# EAGLE design humidor_controller_v32 (EAGLE 6.2)
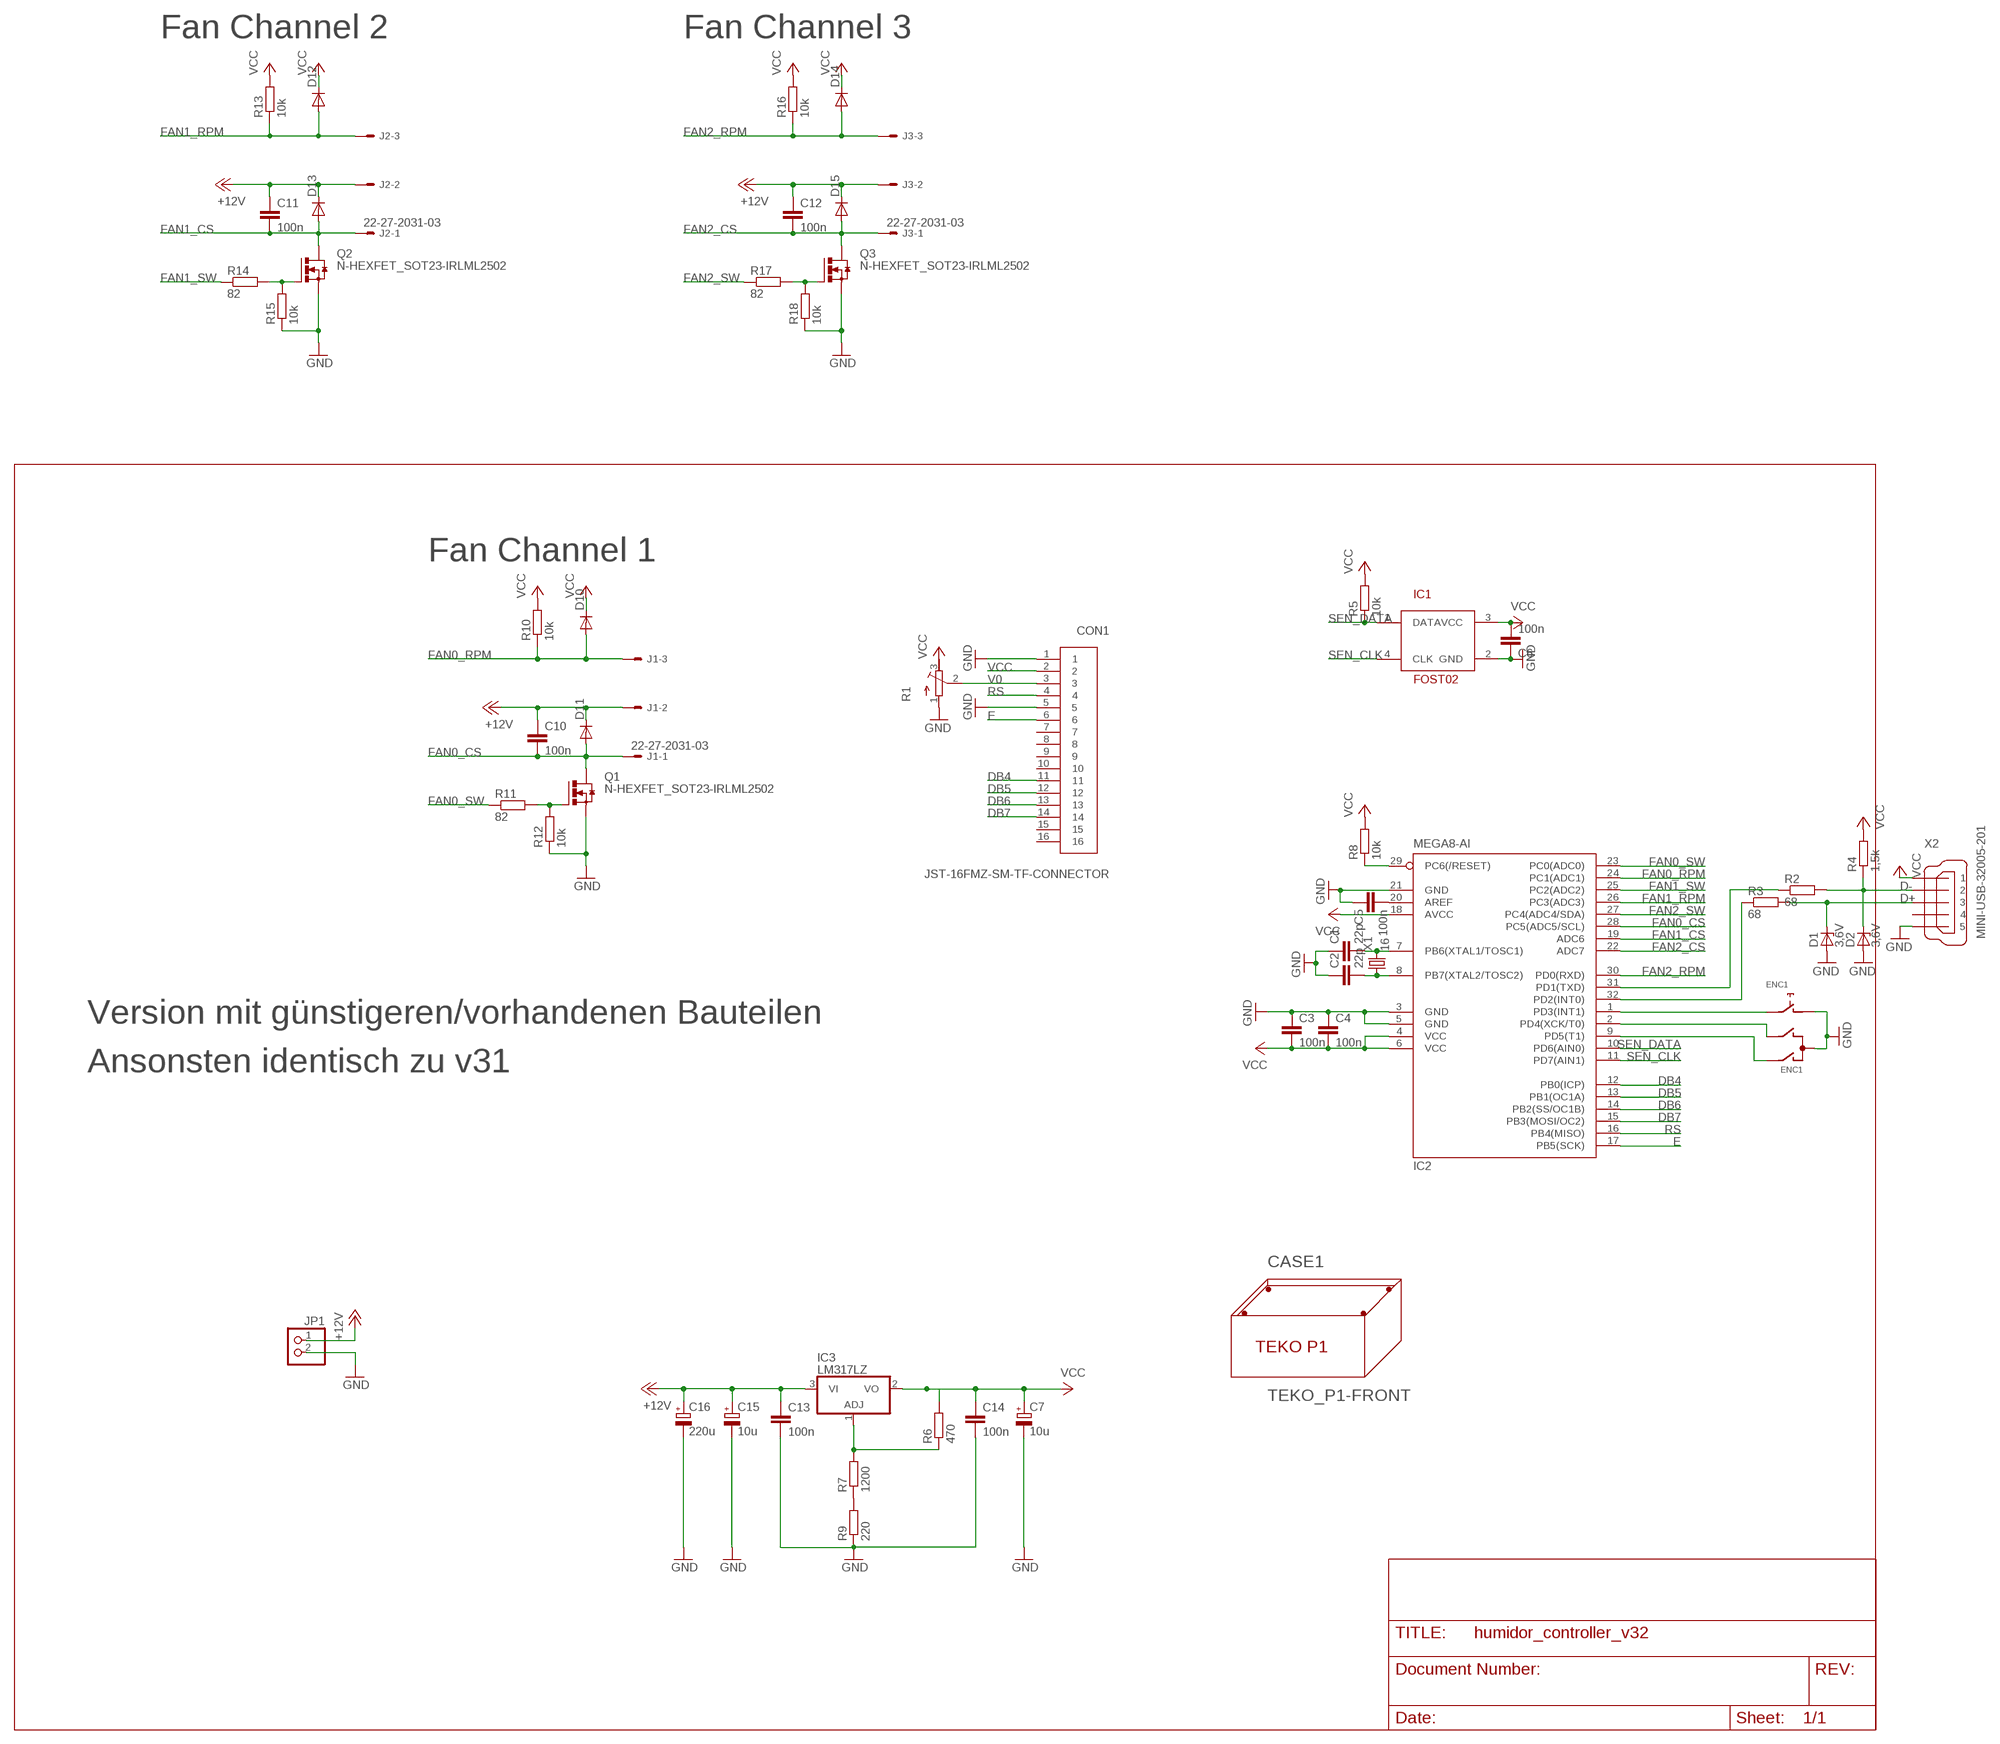
[diagram p0: schematic, sheet 1]

## Parts
C1  22p  C-EUC0805  [C0805]
C2  22p  C-EUC0805  [C0805]
C3  100n  C-EUC0805  [C0805]
C4  100n  C-EUC0805  [C0805]
C5  100n  C-EUC0805  [C0805]
C6  100n  C-EUC0805  [C0805]
C7  10u  CPOL-EUD  [PANASONIC_D]
C10  100n  C-EUC0805  [C0805]
C11  100n  C-EUC0805  [C0805]
C12  100n  C-EUC0805  [C0805]
C13  100n  C-EUC0805  [C0805]
C14  100n  C-EUC0805  [C0805]
C15  10u  CPOL-EUD  [PANASONIC_D]
C16  220u  CPOL-EUG  [PANASONIC_G]
CASE1  TEKO_P1-FRONT  [TEKO_P1_FRONT]
CON1  JST-16FMZ-SM-TF-CONNECTOR  [FFC-16POS-SMT-1MM-HORIZ]
D1  3,6V  ZENER-DIODEDO34-7  [DO34Z7]
D2  3,6V  ZENER-DIODEDO34-7  [DO34Z7]
D10  DIODE-SOD323-R  [SOD323-R]
D11  DIODE-SOD323-R  [SOD323-R]
D12  DIODE-SOD323-R  [SOD323-R]
D13  DIODE-SOD323-R  [SOD323-R]
D14  DIODE-SOD323-R  [SOD323-R]
D15  DIODE-SOD323-R  [SOD323-R]
ENC1  NOBLE_RE0124  [RE0124]
IC1  FOST02  [FOST02]
IC2  MEGA8-AI  [TQFP32-08]
IC3  LM317LZ  [TO92]
J1  22-27-2031-03  [6410-03]
J2  22-27-2031-03  [6410-03]
J3  22-27-2031-03  [6410-03]
JP1  PINHD-1X2  [1X02]
Q1  N-HEXFET_SOT23-IRLML2502  [SOT23]
Q2  N-HEXFET_SOT23-IRLML2502  [SOT23]
Q3  N-HEXFET_SOT23-IRLML2502  [SOT23]
R1  R-TRIMM64W  [RTRIM64W]
R2  68  R-EU_R0805  [R0805]
R3  68  R-EU_R0805  [R0805]
R4  1,5k  R-EU_R0805  [R0805]
R5  10k  R-EU_R0805  [R0805]
R6  470  R-EU_R0805  [R0805]
R7  1200  R-EU_R0805  [R0805]
R8  10k  R-EU_R0805  [R0805]
R9  220  R-EU_R0805  [R0805]
R10  10k  R-EU_R0805  [R0805]
R11  82  R-EU_R0805  [R0805]
R12  10k  R-EU_R0805  [R0805]
R13  10k  R-EU_R0805  [R0805]
R14  82  R-EU_R0805  [R0805]
R15  10k  R-EU_R0805  [R0805]
R16  10k  R-EU_R0805  [R0805]
R17  82  R-EU_R0805  [R0805]
R18  10k  R-EU_R0805  [R0805]
X1  16  CRYSTALHC49UP  [HC49UP]
X2  MINI-USB-32005-201  [32005-201]

## Nets
+12V: C10.1 C11.1 C12.1 C13.1 C15.+ C16.+ D11.C D13.C D15.C IC3.3(VI) J1.2 J2.2 J3.2 JP1.1
D+: D1.C R3.2 X2.3
D-: D2.C R2.2 R4.1 X2.2
DB4: CON1.11 IC2.12(PB0(ICP))
DB5: CON1.12 IC2.13(PB1(OC1A))
DB6: CON1.13 IC2.14(PB2(SS/OC1B))
DB7: CON1.14 IC2.15(PB3(MOSI/OC2))
E: CON1.6 IC2.17(PB5(SCK))
FAN0_CS: C10.2 D11.A IC2.28(PC5(ADC5/SCL)) J1.1 Q1.3(D)
FAN0_RPM: D10.A IC2.24(PC1(ADC1)) J1.3 R10.1
FAN0_SW: IC2.23(PC0(ADC0)) R11.1
FAN1_CS: C11.2 D13.A IC2.19(ADC6) J2.1 Q2.3(D)
FAN1_RPM: D12.A IC2.26(PC3(ADC3)) J2.3 R13.1
FAN1_SW: IC2.25(PC2(ADC2)) R14.1
FAN2_CS: C12.2 D15.A IC2.22(ADC7) J3.1 Q3.3(D)
FAN2_RPM: D14.A IC2.30(PD0(RXD)) J3.3 R16.1
FAN2_SW: IC2.27(PC4(ADC4/SDA)) R17.1
GND: C1.1 C2.1 C3.1 C4.1 C5.1 C6.1 C7.- C13.2 C14.2 C15.- C16.- CON1.1 CON1.5 D1.A D2.A ENC1.+ ENC1.C IC1.2(GND) IC2.3(GND) IC2.5(GND) IC2.21(GND) JP1.2 Q1.2(S) Q2.2(S) Q3.2(S) R1.1(E) R9.1 R12.1 R15.1 R18.1 X2.5
N$1: IC2.29(PC6(/RESET)) R8.1
N$2: C2.2 IC2.8(PB7(XTAL2/TOSC2)) X1.1
N$3: C1.2 IC2.7(PB6(XTAL1/TOSC1)) X1.2
N$4: Q2.1(G) R14.2 R15.2
N$5: Q3.1(G) R17.2 R18.2
N$7: C5.2 IC2.20(AREF)
N$9: Q1.1(G) R11.2 R12.2
N$10: R7.1 R9.2
N$11: IC2.31(PD1(TXD)) R2.1
N$13: ENC1.- IC2.1(PD3(INT1))
N$14: ENC1.B IC2.2(PD4(XCK/T0))
N$15: ENC1.A IC2.9(PD5(T1))
N$16: IC2.32(PD2(INT0)) R3.1
N$17: IC3.1(ADJ) R6.1 R7.2
RS: CON1.4 IC2.16(PB4(MISO))
SEN_CLK: IC1.4(CLK) IC2.11(PD7(AIN1))
SEN_DATA: IC1.1(DATA) IC2.10(PD6(AIN0)) R5.1
V0: CON1.3 R1.2(S)
VCC: C3.2 C4.2 C6.2 C7.+ C14.1 CON1.2 D10.C D12.C D14.C IC1.3(VCC) IC2.4(VCC) IC2.6(VCC) IC2.18(AVCC) IC3.2(VO) R1.3(A) R4.2 R5.2 R6.2 R8.2 R10.2 R13.2 R16.2 X2.1
Unconnected: CON1.7 CON1.8 CON1.9 CON1.10 CON1.15 CON1.16 X2.4

## Notes on the sheet
- Fan Channel 2 | Fan Channel 3
- Fan Channel 1
- Version mit günstigeren/vorhandenen Bauteilen
- Ansonsten identisch zu v31

## Library data of the parts
C1 C2 C13 C14 = rcl:C-EU: CAPACITOR, European symbol
C3-C6 C10-C12 = resistor:C-EU: CAPACITOR, European symbol
C7 C15 C16 = rcl:CPOL-EU: POLARIZED CAPACITOR, European symbol
CASE1 = ferdinandkeil:TEKO_P1-: TEKO P1 Case - Serie Optative 85 x 56 x 35 mm
CON1 = ferdinandkeil:JST-16FMZ-SM-TF-CONNECTOR
D1 D2 = diode:ZENER-DIODE: Z-Diode
D10-D15 = diode:DIODE-: DIODE
ENC1 = ferdinandkeil:NOBLE_RE0124: NOBLE RE0124 Rotary Encoder w/ Push-Button
IC1 = RFMxx:FOST02
IC2 = atmel:MEGA8: MICROCONTROLLER 8 Kbytes FLASH, 1 kbytes SRAM, 512 bytes EEPROM, USART, 6-channel 10 bit ADC, 2-channel 8 bit ADC Pin compatible with Atmega48, ATMega88, ATMega168 Source: avr.lbr
IC3 = linear:*317: Positive VOLTAGE REGULATOR
J1-J3 = con-molex:22-?-03: CONNECTOR wire to board 2.54 mm (.1 inch) pitch header
JP1 = pinhead:PINHD-1X2: PIN HEADER
Q1-Q3 = ferdinandkeil:N-HEXFET_?-*: HEXFET® Power MOSFET
R1 = rcl:R-TRIMM: Trimm resistor
R2-R18 = resistor:R-EU_: RESISTOR, European symbol
X1 = crystal:CRYSTAL: CRYSTAL
X2 = con-cypressindustries:MINI-USB-: MINI USB-B Conector Source: www.cypressindustries.com

## Board
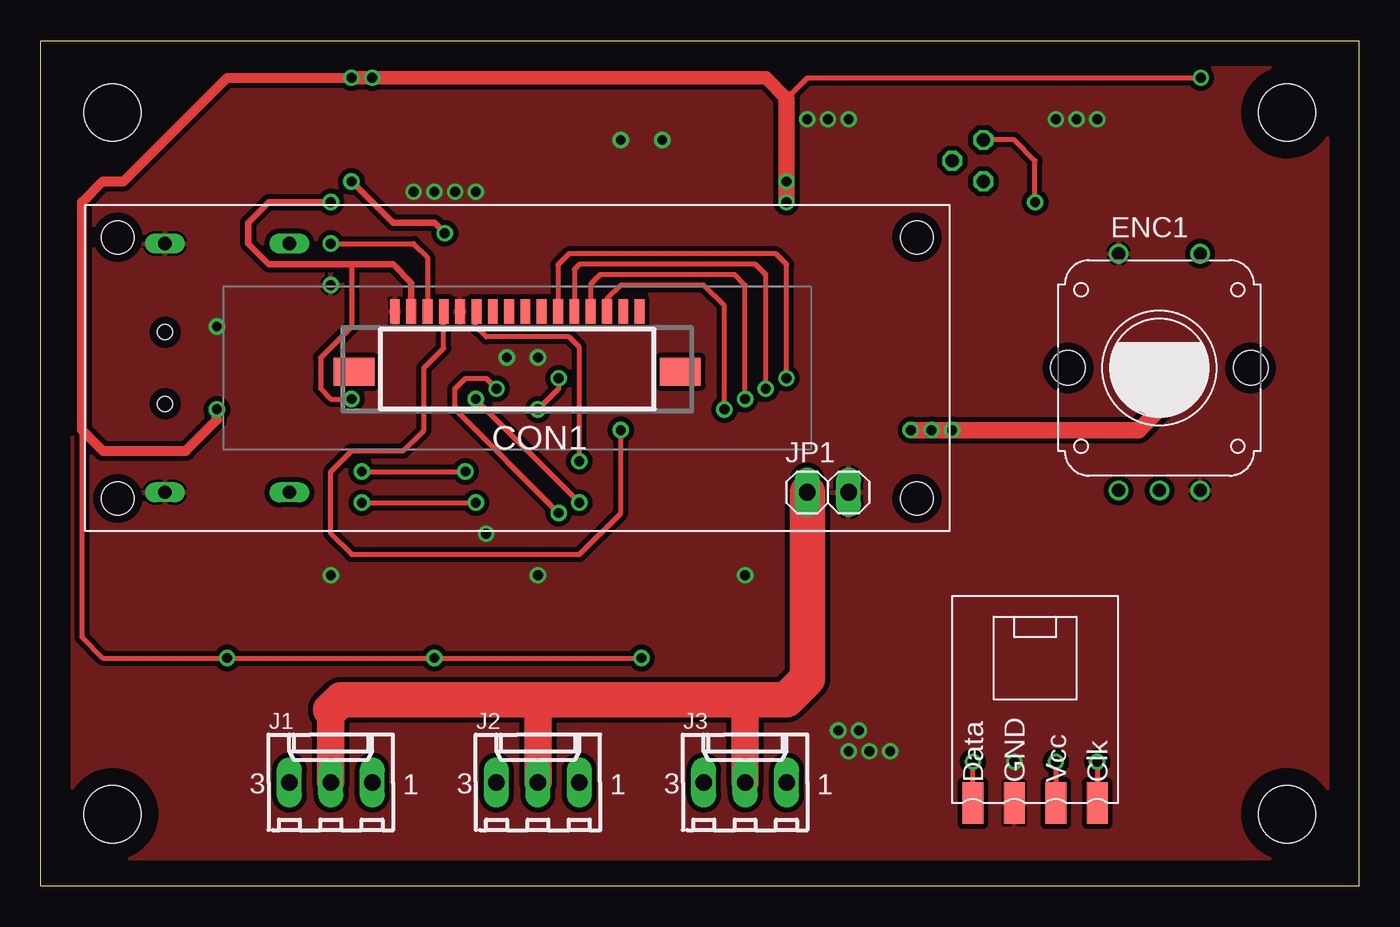
[diagram p1: board, top side]
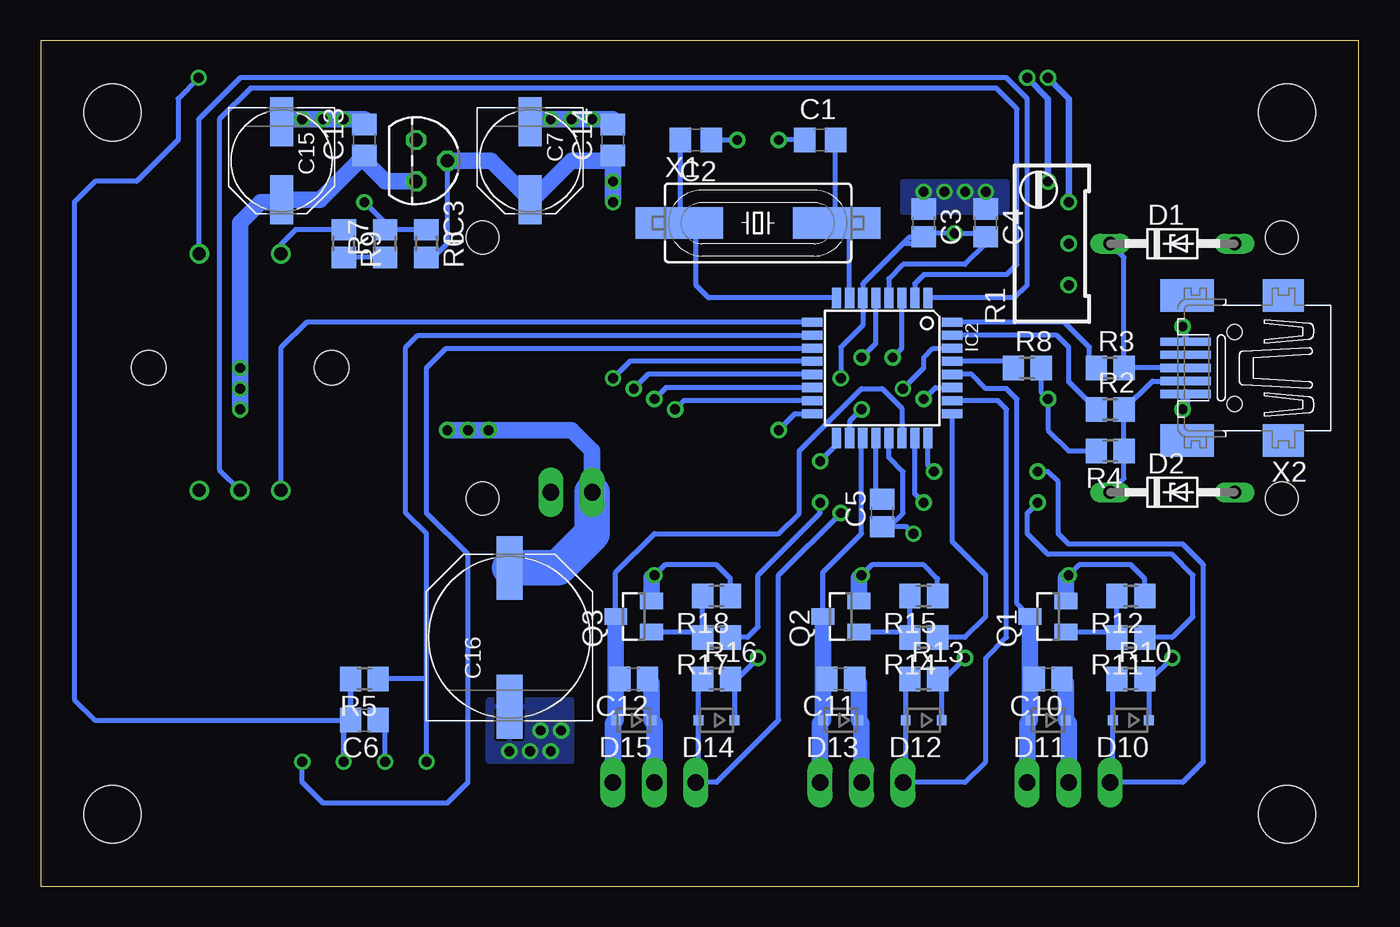
[diagram p2: board, bottom side, seen from below]

Size 80.8 x 51.8 mm. Coordinates in mm from the lower left corner, seen from the top.
Copper layers (1*16): Top 0.035mm / dielectric 1.5mm / Bottom 0.035mm
Design rules "jakob_kleinen": minimum track width 0.15mm, minimum drill 0.3mm, track to track 0.15mm, track to pad 0.15mm, pad to pad 0.15mm, via to via 0.15mm, smd to smd 0.15mm, copper to edge 0.5mm, drill to drill 0.2mm, minimum pad ring 0.2mm, minimum via ring 0.2mm, stop-mask expansion 4mil, vias tented up to drill 0.8mm, thermal gap 0.15mm

### Footprints (pad centres in the part's own frame; a part is rotated, then mirrored left to right if it is on the bottom)
C0805 = smd 1.3 x 1.5: 1 -0.95,0; 2 0.95,0
C0805' = smd 1.3 x 1.5: 1 -0.85,0; 2 0.85,0
PANASONIC_D = smd 3 x 1.4: + 2.4,0; - -2.4,0
PANASONIC_G = smd 3.9 x 1.6: + 4.25,0; - -4.25,0
TEKO_P1_FRONT = hole 3.5: 4.4,4.4; 4.4,47.4; 76.4,4.4; 76.4,47.4
FFC-16POS-SMT-1MM-HORIZ = smd 0.6 x 1.5: 1 7.5,-2.2; 2 6.5,-2.2; 3 5.5,-2.2; 4 4.5,-2.2; 5 3.5,-2.2; 6 2.5,-2.2; 7 1.5,-2.2; 8 0.5,-2.2; 9 -0.5,-2.2; 10 -1.5,-2.2; 11 -2.5,-2.2; 12 -3.5,-2.2; 13 -4.5,-2.2; 14 -5.5,-2.2; 15 -6.5,-2.2; 16 -7.5,-2.2 | smd 2.5 x 1.7: 17 10,1.5; 18 -10,1.5
DO34Z7 = drill 0.813 long: A 3.81,0; C -3.81,0
SOD323-R = smd 0.6 x 0.6: A 1.1,0; C -1.1,0
RE0124 = drill 0.8 pad 1 round: + -2.5,7; - 2.5,7; A -2.5,-7.5; B 0,-7.5; C 2.5,-7.5 | hole 2.1: -5.6,0; 5.6,0
FOST02 = smd 1.27 x 2.54: 1 -3.81,-10.16; 2 -1.27,-10.16; 3 1.27,-10.16; 4 3.81,-10.16
TQFP32-08 = smd 1.27 x 0.559: 1 -4.293,2.8; 2 -4.293,2; 3 -4.293,1.2; 4 -4.293,0.4; 5 -4.293,-0.4; 6 -4.293,-1.2; 7 -4.293,-2; 8 -4.293,-2.8; 17 4.293,-2.8; 18 4.293,-2; 19 4.293,-1.2; 20 4.293,-0.4; 21 4.293,0.4; 22 4.293,1.2; 23 4.293,2; 24 4.293,2.8 | smd 0.559 x 1.27: 9 -2.8,-4.293; 10 -2,-4.293; 11 -1.2,-4.293; 12 -0.4,-4.293; 13 0.4,-4.293; 14 1.2,-4.293; 15 2,-4.293; 16 2.8,-4.293; 25 2.8,4.293; 26 2,4.293; 27 1.2,4.293; 28 0.4,4.293; 29 -0.4,4.293; 30 -1.2,4.293; 31 -2,4.293; 32 -2.8,4.293
TO92 = drill 0.813 octagon: 1 -1.27,0; 2 0,1.905; 3 1.27,0
6410-03 = drill 1.016 long: 1 2.54,0; 2 0,0; 3 -2.54,0
1X02 = drill 1.016 long: 1 -1.27,0; 2 1.27,0
SOT23 = smd 1 x 1.4: 1 -0.95,-1.1; 2 0.95,-1.1; 3 0,1.1
RTRIM64W = drill 0.61 round: 1 1.27,-2.54; 2 1.27,0; 3 1.27,2.54
R0805 = smd 1.3 x 1.5: 1 -0.85,0; 2 0.85,0
LCD_HMC16223SG = hole 2: -24.5,-8; -24.5,8; 24.5,8; 24.5,-8
HC49UP = smd 5.334 x 1.93: 1 -4.826,0; 2 4.826,0
32005-201 = smd 3.1 x 0.5: 1 3,1.6; 2 3,0.8; 3 3,0; 4 3,-0.8; 5 3,-1.6 | smd 2.5 x 2: M1 -3,-4.45; M2 -3,4.45 | smd 3.3 x 2: M3 2.9,4.45; M4 2.9,-4.45 | hole 0.9: 0,2.2; 0,-2.2

### Placement (x,y rotation side)
C1  33.02,45.72 0 bottom
C2  40.64,45.72 180 bottom
C3  100n  [C0805']  26.67,40.64 270 bottom
C4  100n  [C0805']  22.86,40.64 270 bottom
C5  100n  [C0805']  29.21,22.86 90 bottom
C6  100n  [C0805']  60.96,10.16 180 bottom
C7  50.8,44.45 270 bottom
C10  100n  [C0805']  19.05,12.7 180 bottom
C11  100n  [C0805']  31.75,12.7 180 bottom
C12  100n  [C0805']  44.45,12.7 180 bottom
C13  60.96,45.72 90 bottom
C14  45.72,45.72 90 bottom
C15  66.04,44.45 270 bottom
C16  52.07,15.24 90 bottom
CASE1  0,0 0 top
CON1  29.21,33.02 180 top
D1  11.43,39.37 0 bottom
D2  11.43,24.13 0 bottom
D10  13.97,10.16 180 bottom
D11  19.05,10.16 180 bottom
D12  26.67,10.16 180 bottom
D13  31.75,10.16 180 bottom
D14  39.37,10.16 180 bottom
D15  44.45,10.16 180 bottom
ENC1  68.58,31.75 0 top
IC1  60.96,15.24 0 top
IC2  29.21,31.75 270 bottom
IC3  57.78,44.45 270 bottom
J1  17.78,6.35 0 top
J2  30.48,6.35 0 top
J3  43.18,6.35 0 top
JP1  48.26,24.13 0 top
Q1  19.05,16.51 90 bottom
Q2  31.75,16.51 90 bottom
Q3  44.45,16.51 90 bottom
R1  19.05,39.37 0 bottom
R2  15.24,29.21 0 bottom
R3  15.24,31.75 0 bottom
R4  15.24,26.67 180 bottom
R5  60.96,12.7 180 bottom
R6  57.15,39.37 270 bottom
R7  59.69,39.37 90 bottom
R8  20.32,31.75 0 bottom
R9  62.23,39.37 270 bottom
R10  13.97,12.7 0 bottom
R11  13.97,15.24 180 bottom
R12  13.97,17.78 180 bottom
R13  26.67,12.7 0 bottom
R14  26.67,15.24 180 bottom
R15  26.67,17.78 180 bottom
R16  39.37,12.7 0 bottom
R17  39.37,15.24 180 bottom
R18  39.37,17.78 180 bottom
U$1  [LCD_HMC16223SG]  29.21,31.75 0 top
X1  36.83,40.64 0 bottom
X2  7.62,31.75 180 bottom

### Tracks (layer width: path | path; a pad name or v marks a point on that pad's centre or on a via)
+12V  (via drill 0.6)
  Top 1.016: v53.34,27.94 v54.61,27.94 v55.88,27.94 67.31,27.94 v68.58,29.21 v68.58,30.48 v68.58,31.75
  Top 1.676: 18.41,11.43 18.41,11.26 30.48,11.26 | 30.65,11.43 30.48,11.26 | 30.48,11.26 J2.2 | 43.18,11.43 J3.2 | J1.2 17.78,10.79
  Top 2.184: 17.78,10.79 18.41,11.43 30.65,11.43 43.18,11.43 45.72,11.43 46.99,12.7 JP1.1
  Bottom 1.016: J1.2 17.78,9.99 D11.C 17.95,12.45 C10.1 | J2.2 30.48,9.99 D13.C 30.65,12.45 C11.1 | J3.2 43.18,9.99 D15.C 43.35,12.45 C12.1 | 61.44,44.29 C13.1 60.96,44.45 59.69,43.18 IC3.3 | 61.44,44.29 63.68,42.05 C15.+ 66.04,41.91 67.31,41.91 68.58,40.64 v68.58,31.75 v68.58,29.21 | 61.44,44.29 61.28,44.45 | JP1.1 46.99,26.67 48.26,27.94 v53.34,27.94 v55.88,27.94
  Bottom 2.184: C16.+ 49.09,19.49 46.99,21.59 JP1.1
D+
  Bottom 0.305: X2.3 R3.2 14.39,38.52 D1.C
D-
  Bottom 0.305: X2.2 12.65,30.95 R2.2 R4.1 14.39,24.98 D2.C
DB4  (via drill 0.6)
  Top 0.305: CON1.11 31.71,38.06 32.38,38.73 45.09,38.73 45.72,38.1 v45.72,31.11
  Bottom 0.305: IC2.12 44.69,32.15 v45.72,31.11
DB5  (via drill 0.6)
  Top 0.305: CON1.12 32.71,37.79 33.02,38.1 43.81,38.1 44.45,37.47 v44.45,30.48
  Bottom 0.305: IC2.13 43.58,31.35 v44.45,30.48
DB6  (via drill 0.6)
  Top 0.305: CON1.13 33.71,36.88 34.29,37.47 42.55,37.47 43.18,36.83 v43.18,29.84
  Bottom 0.305: IC2.14 42.48,30.55 v43.18,29.84
DB7  (via drill 0.6)
  Top 0.305: v41.91,29.21 41.91,35.56 40.64,36.83 35.56,36.83 34.71,35.98 CON1.14
  Bottom 0.305: IC2.15 41.37,29.75 v41.91,29.21
E  (via drill 0.6)
  Top 0.305: CON1.6 26.67,35.18 26.67,34.29 27.3,33.66 32.38,33.66 33.02,33.02 v33.02,26.04
  Bottom 0.305: IC2.17 32.01,27.05 v33.02,26.04
FAN0_CS
  Bottom 0.305: 20.32,16.68 Q1.3 20.95,17.32 20.95,29.84 21.59,30.48 22.86,30.48 23.73,31.35 IC2.28
  Bottom 1.016: J1.1 20.32,9.99 D11.A 20.15,12.7 | 20.15,12.7 Q1.3 | 20.15,12.7 C10.2
FAN0_RPM  (via drill 0.6)
  Top 0.305: v19.68,25.4 v26.04,25.4
  Bottom 0.305: R10.1 15.07,12.45 D10.A 15.07,6.52 J1.3 10.79,6.35 9.53,7.62 9.53,19.68 10.79,20.95 17.78,20.95 18.41,21.59 18.41,24.77 19.05,25.4 v19.68,25.4 | IC2.24 26.41,25.77 v26.04,25.4
FAN0_SW  (via drill 0.6)
  Top 0.305: v19.68,23.5 v26.67,23.5
  Bottom 0.305: R11.1 11.43,15.24 10.16,16.51 10.16,19.05 11.43,20.32 19.05,20.32 20.32,21.59 20.32,22.86 v19.68,23.5 | IC2.23 27.21,24.04 v26.67,23.5
FAN1_CS
  Bottom 0.305: Q2.3 32.85,19.22 30.48,21.59 30.48,27.39 IC2.19
  Bottom 1.016: J2.1 33.02,9.99 D13.A 32.85,12.7 | 32.85,12.7 Q2.3 | 32.85,12.7 C11.2
FAN1_RPM
  Bottom 0.305: R13.1 27.77,12.45 D12.A 27.77,6.52 J2.3 24.13,6.35 22.86,7.62 22.86,13.97 21.59,15.24 21.59,29.21 22.13,29.75 IC2.26
FAN1_SW
  Bottom 0.305: R14.1 24.13,15.24 22.86,16.51 22.86,19.05 24.92,21.11 IC2.25
FAN2_CS
  Bottom 0.305: Q3.3 45.55,19.22 43.18,21.59 35.56,21.59 34.29,22.86 34.29,26.67 30.48,30.48 29.21,30.48 28.01,29.28 IC2.22
  Bottom 1.016: J3.1 45.72,9.99 D15.A 45.55,12.7 | 45.55,12.7 Q3.3 | 45.55,12.7 C12.2
FAN2_RPM  (via drill 0.6)
  Top 0.305: v31.75,22.86 25.4,29.21 25.4,30.48 26.04,31.11 27.3,31.11 v27.94,30.48
  Bottom 0.305: R16.1 40.47,12.45 D14.A 40.47,6.52 J3.3 39.37,6.35 35.56,10.16 35.56,19.05 v31.75,22.86 | IC2.30 26.11,32.95 26.67,32.38 26.67,31.75 v27.94,30.48
FAN2_SW  (via drill 0.6)
  Top 0.305: v33.02,23.5 v26.67,29.84
  Bottom 0.305: IC2.27 25.96,30.55 v26.67,29.84 | v33.02,23.5 33.02,22.86 36.83,19.05 36.83,15.88 37.47,15.24 R17.1
GND  (via drill 0.6)
  Bottom 0.305: R12.1 13.12,18.84 13.97,19.68 17.14,19.68 v17.78,19.05 | R15.1 25.82,18.84 26.67,19.68 29.84,19.68 v30.48,19.05 | R18.1 38.52,18.84 39.37,19.68 42.55,19.68 v43.18,19.05 | IC2.21 28.81,26.27 27.94,25.4 27.94,22.86 28.79,22.01 C5.1 27.73,22.01 v27.3,21.59 | IC2.3 28.01,32.95 v28.57,32.38 | IC2.5 29.61,33.26 v30.48,32.38 | v59.69,7.62 59.69,9.74 C6.1 | R9.1 65.19,40.22 66.04,39.37 66.04,38.79 ENC1.+ | C1.1 v35.56,45.72 | C2.1 v38.1,45.72
  Bottom 0.406: X2.5 10.62,34.12 v10.79,34.29
  Bottom 0.61: C14.2 46.03,46.35
  Bottom 1.016: Q2.2 30.65,18.88 v30.48,19.05 | Q1.2 17.95,18.88 v17.78,19.05 | Q3.2 43.35,18.88 v43.18,19.05 | C14.2 45.72,46.99 v46.99,46.99 v48.26,46.99 v49.53,46.99 50.66,46.99 C7.- | C13.2 60.96,46.99 v62.23,46.99 v63.5,46.99 v64.77,46.99 65.9,46.99 C15.-
  other vias: 22.86,42.55 24.13,42.55 25.4,42.55 26.67,42.55 50.16,9.53 50.8,8.26 52.07,8.26 49.53,8.26 48.9,9.53
  pour Top (isolate 0.305): -1.27,53.34 82.55,53.34 82.55,50.8 82.55,-2.54 -1.27,-2.54
  pour Bottom (isolate 0.305, no thermals): 21.59,43.18 21.59,41.27 27.94,41.27 27.94,43.18
  pour Bottom: 53.34,11.43 48.26,11.43 48.26,7.62 53.34,7.62
N$1
  Bottom 0.305: IC2.29 21.57,32.15 R8.1
N$2
  Bottom 0.305: IC2.8 39.85,36.04 40.64,36.83 40.64,40.64 X1.1 41.59,40.71 C2.2
N$3
  Bottom 0.305: IC2.7 31.21,40.1 31.75,40.64 X1.2 32.07,40.71 C1.2
N$4
  Bottom 0.305: Q2.1 27.84,15.56 R14.2 R15.2
N$5
  Bottom 0.305: R18.2 R17.2 40.54,15.56 Q3.1
N$7
  Bottom 0.305: IC2.20 29.61,24.11 C5.2
N$9
  Bottom 0.305: Q1.1 15.14,15.56 R11.2 R12.2
N$10
  Bottom 0.305: R7.1 R9.2
N$11
  Bottom 0.305: R2.1 17.78,30.9 17.78,33.02 18.51,33.75 IC2.31
N$13
  Bottom 0.305: IC2.1 21.11,36.04 20.32,36.83 20.32,48.26 21.59,49.53 68.58,49.53 71.12,46.99 71.12,38.79 ENC1.-
N$14
  Bottom 0.305: IC2.2 27.21,36.92 26.67,37.47 21.59,37.47 20.95,38.1 20.95,47.62 22.23,48.9 67.94,48.9 69.85,46.99 69.85,25.52 ENC1.B
N$15
  Bottom 0.305: ENC1.A 66.08,32.98 64.51,34.55 IC2.9
N$16
  Bottom 0.305: IC2.32 18.04,34.55 16.51,33.02 16.51,32.17 R3.1
N$17  (via drill 0.6)
  Top 0.305: v60.96,41.91 60.96,44.45 59.69,45.72 IC3.1
  Bottom 0.305: v60.96,41.91 59.69,40.64 R7.2 R6.1
RS  (via drill 0.6)
  Top 0.305: CON1.4 24.71,32.97 23.5,31.75 23.5,27.94 22.23,26.67 19.05,26.67 17.78,25.4 17.78,21.59 19.05,20.32 33.02,20.32 35.56,22.86 v35.56,27.94
  Bottom 0.305: IC2.16 34.55,28.95 v35.56,27.94
SEN_CLK  (via drill 0.6)
  Top 0.305: v64.77,7.62 IC1.4
  Bottom 0.305: v64.77,7.62 64.77,6.35 63.5,5.08 55.88,5.08 54.61,6.35 54.61,20.32 57.15,22.86 57.15,31.75 55.95,32.95 IC2.11
SEN_DATA  (via drill 0.6)
  Top 0.305: IC1.1 v57.15,7.62
  Bottom 0.305: v57.15,7.62 57.15,12.7 | 57.15,12.7 57.15,21.59 58.42,22.86 58.42,33.02 57.69,33.75 IC2.10 | 57.15,12.7 R5.1
V0
  Top 0.305: CON1.3 23.71,38.52 22.86,39.37 R1.2
VCC  (via drill 0.6)
  Top 0.305: v62.23,7.62 IC1.3 | v36.83,13.97 v24.13,13.97 v11.43,13.97 3.81,13.97 2.54,15.24 2.54,27.94 | v19.05,29.84 17.78,29.84 17.14,30.48 17.14,32.38 19.05,34.29 19.05,38.1 | v71.12,49.53 46.99,49.53 45.72,48.26 | v31.75,31.11 31.75,30.48 v30.48,29.21
  Top 0.406: CON1.2 22.71,36.98 21.59,38.1 19.05,38.1 13.97,38.1 12.7,39.37 12.7,40.64 13.97,41.91 R1.3 | v24.77,40.01 24.13,40.64 21.59,40.64 v19.05,43.18
  Top 0.61: v10.79,29.21 10.79,28.57 8.89,26.67 3.81,26.67 2.54,27.94 2.54,41.91 3.81,43.18 5.08,43.18 11.43,49.53 v19.05,49.53
  Top 0.813: 45.72,48.26 44.45,49.53 v20.32,49.53 v19.05,49.53
  Top 1.016: 45.72,48.26 v45.72,41.91
  Bottom 0.305: D10.C 12.87,12.45 R10.2 12.7,12.7 v11.43,13.97 | 38.27,12.45 D14.C | 38.27,12.45 R16.2 | C3.2 27.52,39.79 27.94,39.37 | IC2.4 28.81,37.23 27.94,38.1 24.13,38.1 22.86,39.37 | 22.86,39.37 C4.2 | 25.57,12.45 D12.C | 25.57,12.45 R13.2 | IC2.18 31.21,28.48 v30.48,29.21 | 22.86,39.37 22.86,40.01 v24.77,40.01 26.67,40.01 26.67,39.37 27.94,39.37 | 27.94,39.37 30.41,36.9 IC2.6 30.41,34.36 31.75,33.02 v31.75,31.11 | R8.2 19.47,30.27 v19.05,29.84 19.05,27.94 17.78,26.67 R4.2 | 62.23,10.16 61.81,10.58 R5.2 C6.2 62.23,9.74 v62.23,7.62 62.23,10.16 | 62.23,10.16 77.47,10.16 78.74,11.43 78.74,41.91 77.47,43.18 74.93,43.18 72.39,45.72 72.39,48.26 v71.12,49.53 | 38.27,12.45 38.27,12.53 v36.83,13.97 | 25.57,12.45 25.57,12.53 v24.13,13.97 | IC3.2 55.88,39.37 57.15,38.1 R6.2
  Bottom 0.406: R1.3 17.78,48.26 v19.05,49.53 | v19.05,43.18 19.05,48.26 v20.32,49.53
  Bottom 0.61: X2.1 10.62,29.39 v10.79,29.21
  Bottom 1.016: v45.72,41.91 v45.72,43.18 C14.1 46.04,44.45 48.26,44.45 50.66,42.05 C7.+ 53.2,44.45 IC3.2